# EAGLE design pcb_v2.3 (EAGLE 9.1.1)
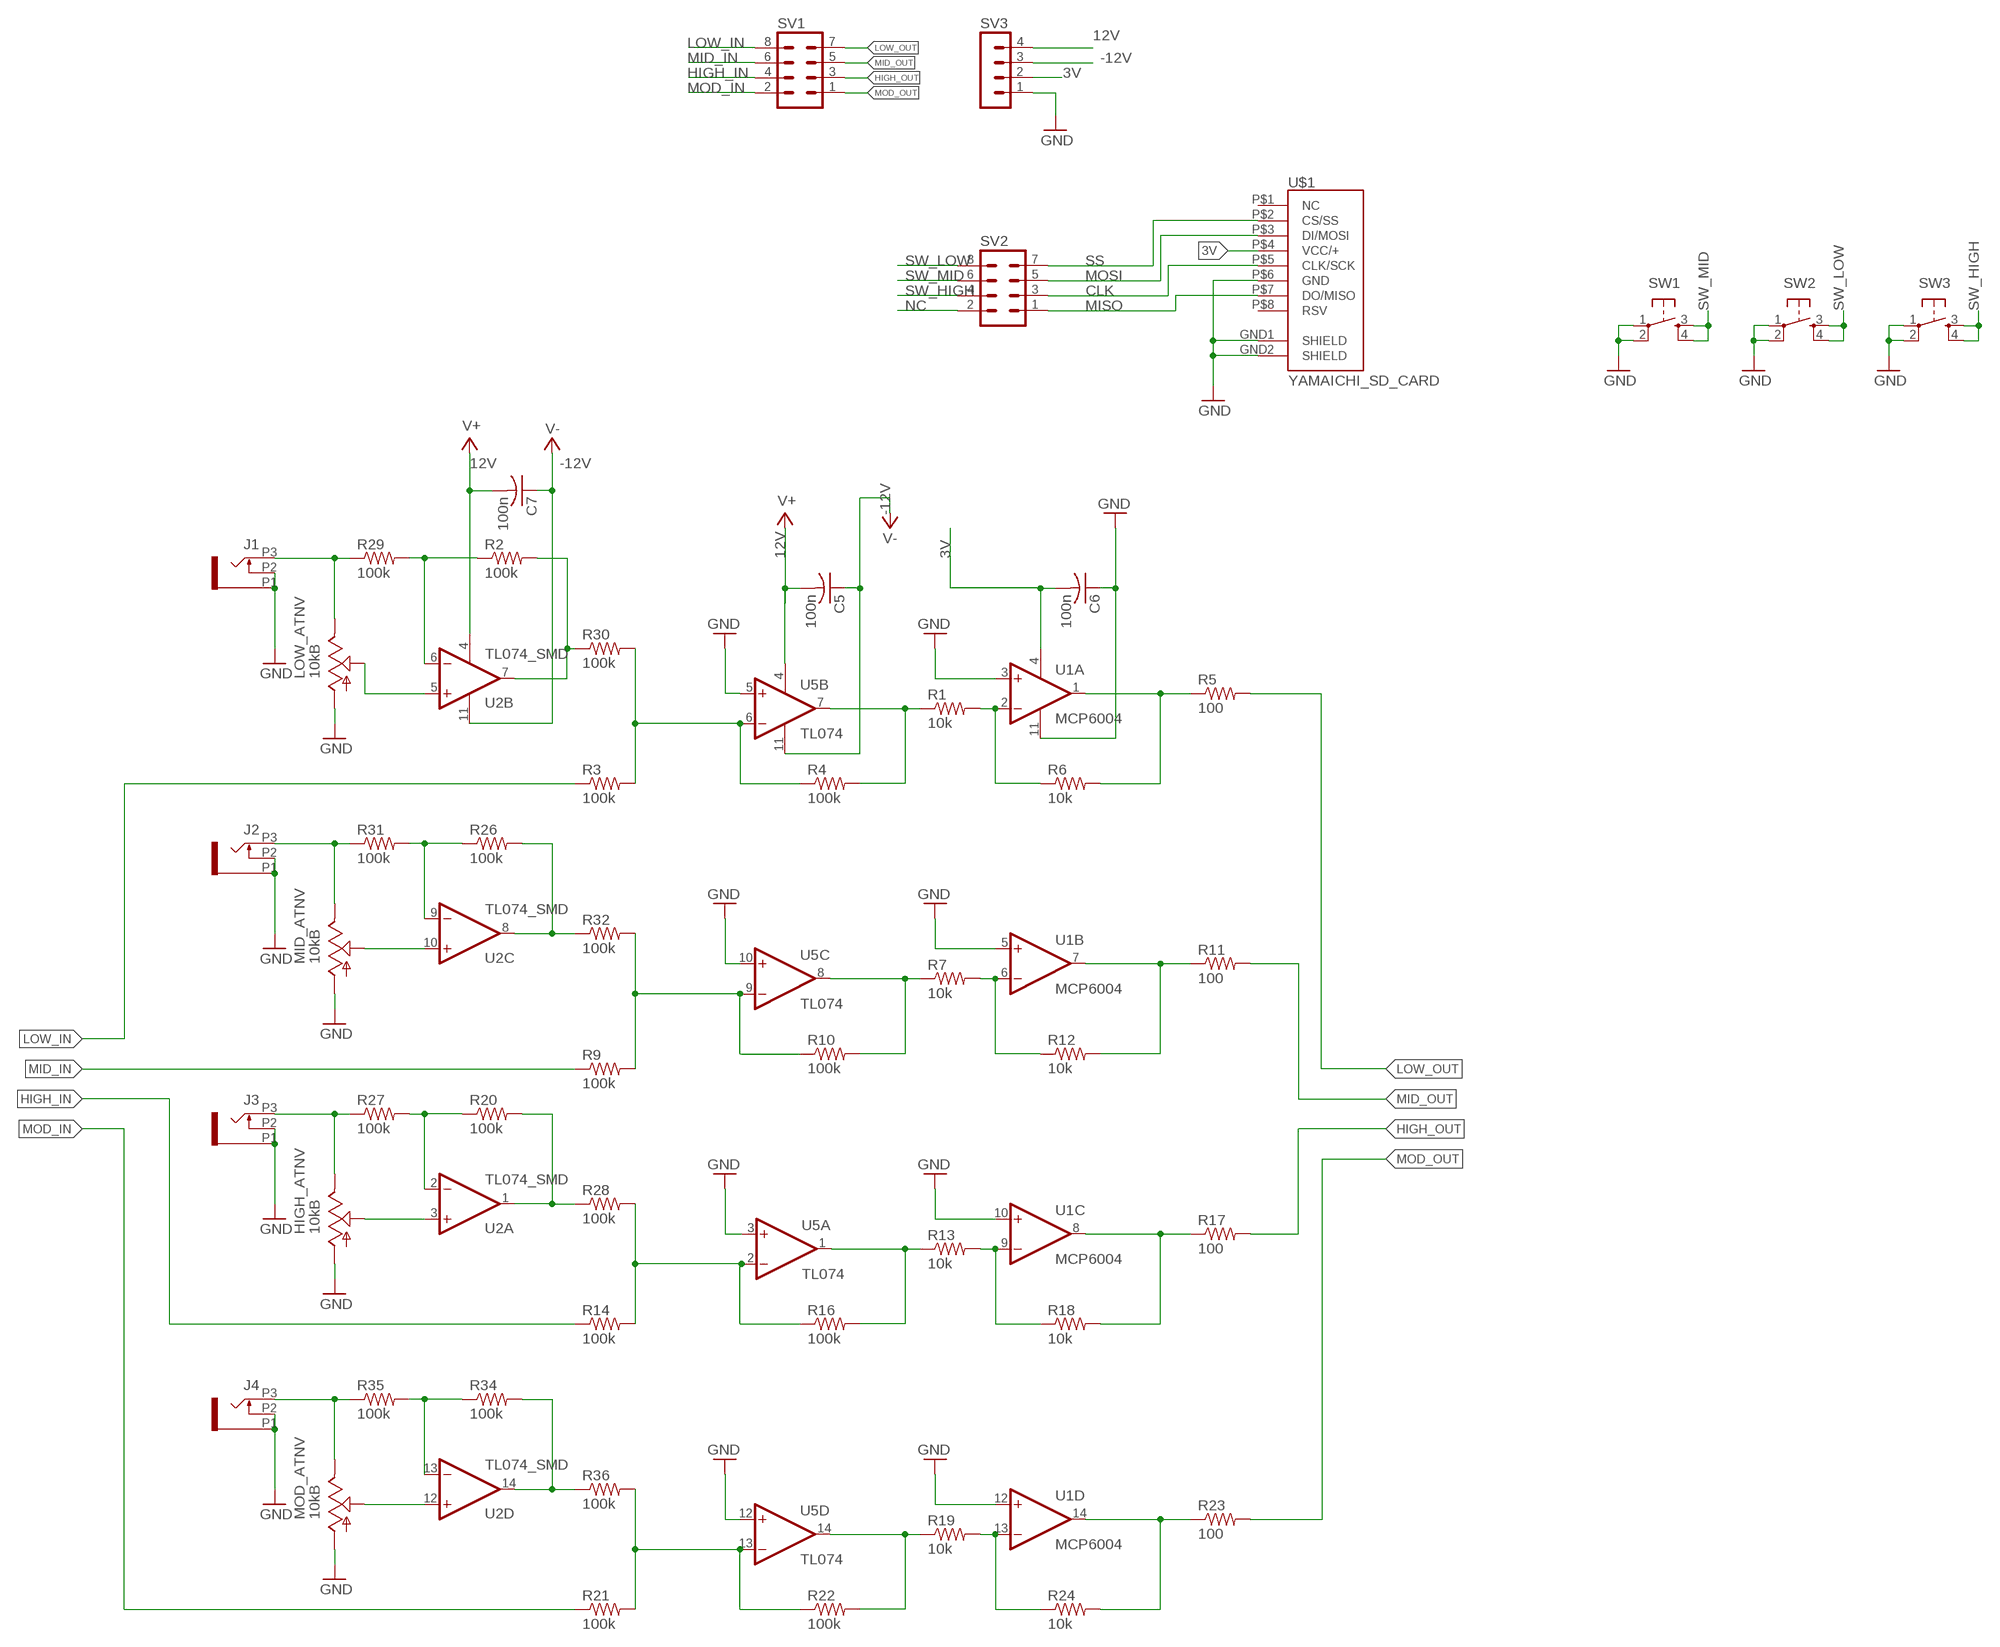
[diagram p0: schematic, sheet 1]

## Parts
C5  100n  C-USC0603  [C0603]
C6  100n  C-USC0603  [C0603]
C7  100n  C-USC0603  [C0603]
HIGH_ATNV  10kB  POT_USVERTICAL  [ALPS_POT_VERTICAL]
J1  PJ301_THONKICONN6  [WQP_PJ_301M6]
J2  PJ301_THONKICONN6  [WQP_PJ_301M6]
J3  PJ301_THONKICONN6  [WQP_PJ_301M6]
J4  PJ301_THONKICONN6  [WQP_PJ_301M6]
LOW_ATNV  10kB  POT_USVERTICAL  [ALPS_POT_VERTICAL]
MID_ATNV  10kB  POT_USVERTICAL  [ALPS_POT_VERTICAL]
MOD_ATNV  10kB  POT_USVERTICAL  [ALPS_POT_VERTICAL]
R1  10k  R-US_R0603  [R0603]
R2  100k  R-US_R0603  [R0603]
R3  100k  R-US_R0603  [R0603]
R4  100k  R-US_R0603  [R0603]
R5  100  R-US_R0603  [R0603]
R6  10k  R-US_R0603  [R0603]
R7  10k  R-US_R0603  [R0603]
R9  100k  R-US_R0603  [R0603]
R10  100k  R-US_R0603  [R0603]
R11  100  R-US_R0603  [R0603]
R12  10k  R-US_R0603  [R0603]
R13  10k  R-US_R0603  [R0603]
R14  100k  R-US_R0603  [R0603]
R16  100k  R-US_R0603  [R0603]
R17  100  R-US_R0603  [R0603]
R18  10k  R-US_R0603  [R0603]
R19  10k  R-US_R0603  [R0603]
R20  100k  R-US_R0603  [R0603]
R21  100k  R-US_R0603  [R0603]
R22  100k  R-US_R0603  [R0603]
R23  100  R-US_R0603  [R0603]
R24  10k  R-US_R0603  [R0603]
R26  100k  R-US_R0603  [R0603]
R27  100k  R-US_R0603  [R0603]
R28  100k  R-US_R0603  [R0603]
R29  100k  R-US_R0603  [R0603]
R30  100k  R-US_R0603  [R0603]
R31  100k  R-US_R0603  [R0603]
R32  100k  R-US_R0603  [R0603]
R34  100k  R-US_R0603  [R0603]
R35  100k  R-US_R0603  [R0603]
R36  100k  R-US_R0603  [R0603]
SV1  MA04-2  [MA04-2]
SV2  MA04-2  [MA04-2]
SV3  MA04-1  [MA04-1]
SW1  TAC_SWITCHPTH  [TACTILE-PTH]
SW2  TAC_SWITCHPTH  [TACTILE-PTH]
SW3  TAC_SWITCHPTH  [TACTILE-PTH]
U1  MCP6004  MCP6004_SMD  [SO14]
U2  TL074_SMD  [SO14]
U5  TL074  TL074_SMD  [SO14]
U$1  YAMAICHI_SD_CARD  [YAMAICHI_MICROSD_VERTICAL]

## Nets
3V: C6.2 SV3.2 U1.4(P:V+) U$1.P$4(VCC/+)
12V: C5.2 C7.2 SV3.4 U2.4(P:V+) U5.4(P:V+) ; supply symbol labelled V+
-12V: C5.1 C7.1 SV3.3 U2.11(P:V-) U5.11(P:V-) ; supply symbol labelled V-
CLK: SV2.3 U$1.P$5(CLK/SCK)
GND: C6.1 HIGH_ATNV.P$3(A) J1.P1 J1.P2 J2.P1 J2.P2 J3.P1 J3.P2 J4.P1 J4.P2 LOW_ATNV.P$3(A) MID_ATNV.P$3(A) MOD_ATNV.P$3(A) SV3.1 SW1.1 SW1.2 SW2.1 SW2.2 SW3.1 SW3.2 U1.3(A:+IN) U1.5(B:+IN) U1.10(C:+IN) U1.11(P:V-) U1.12(D:+IN) U5.3(A:+IN) U5.5(B:+IN) U5.10(C:+IN) U5.12(D:+IN) U$1.GND1(SHIELD) U$1.GND2(SHIELD) U$1.P$6(GND)
HIGH_ATNV_FDBK: R20.1 R27.2 U2.2(A:-IN)
HIGH_IN: R14.1 SV1.4
HIGH_OUT: R17.2 SV1.3
HIGH_SUM_OUT: R13.1 R16.2 U5.1(A:OUT)
LOW_ATNV_FDBK: R2.1 R29.2 U2.6(B:-IN)
LOW_IN: R3.1 SV1.8
LOW_OUT: R5.2 SV1.7
LOW_SUM_OUT: R1.1 R4.2 U5.7(B:OUT)
MID_ATNV_FDBK: R26.1 R31.2 U2.9(C:-IN)
MID_IN: R9.1 SV1.6
MID_OUT: R11.2 SV1.5
MID_SUM_OUT: R7.1 R10.2 U5.8(C:OUT)
MISO: SV2.1 U$1.P$7(DO/MISO)
MOD_ATNV_FDBK: R34.1 R35.2 U2.13(D:-IN)
MOD_IN: R21.1 SV1.2
MOD_OUT: R23.2 SV1.1
MOD_SUM_OUT: R19.1 R22.2 U5.14(D:OUT)
MOSI: SV2.5 U$1.P$3(DI/MOSI)
N$1: MID_ATNV.P$2(S) U2.10(C:+IN)
N$2: R1.2 R6.1 U1.2(A:-IN)
N$3: R2.2 R30.1 U2.7(B:OUT)
N$4: LOW_ATNV.P$2(S) U2.5(B:+IN)
N$5: R5.1 R6.2 U1.1(A:OUT)
N$6: R3.2 R4.1 R30.2 U5.6(B:-IN)
N$7: HIGH_ATNV.P$2(S) U2.3(A:+IN)
N$8: R9.2 R10.1 R32.2 U5.9(C:-IN)
N$9: R7.2 R12.1 U1.6(B:-IN)
N$12: HIGH_ATNV.P$1(E) J3.P3 R27.1
N$13: R20.2 R28.1 U2.1(A:OUT)
N$23: R13.2 R18.1 U1.9(C:-IN)
N$24: R19.2 R24.1 U1.13(D:-IN)
N$26: R11.1 R12.2 U1.7(B:OUT)
N$27: R17.1 R18.2 U1.8(C:OUT)
N$28: R23.1 R24.2 U1.14(D:OUT)
N$30: J1.P3 LOW_ATNV.P$1(E) R29.1
N$32: J2.P3 MID_ATNV.P$1(E) R31.1
N$33: R26.2 R32.1 U2.8(C:OUT)
N$34: MOD_ATNV.P$2(S) U2.12(D:+IN)
N$35: J4.P3 MOD_ATNV.P$1(E) R35.1
N$36: R34.2 R36.1 U2.14(D:OUT)
N$37: R14.2 R16.1 R28.2 U5.2(A:-IN)
N$38: R21.2 R22.1 R36.2 U5.13(D:-IN)
NC: SV2.2
SS: SV2.7 U$1.P$2(CS/SS)
SW_HIGH: SV2.4 SW3.3 SW3.4
SW_LOW: SV2.8 SW2.3 SW2.4
SW_MID: SV2.6 SW1.3 SW1.4
Unconnected: U$1.P$1(NC) U$1.P$8(RSV)

## Library data of the parts
C5-C7 = rcl:C-US: CAPACITOR, American symbol; SPICEPREFIX: C
HIGH_ATNV LOW_ATNV MID_ATNV MOD_ATNV = og-pots:POT_US
J1-J4 = og-pj301:PJ301_THONKICONN; SPICEPREFIX: J
R1-R7 R9-R14 R16-R24 R26-R32 R34-R36 = rcl:R-US_: RESISTOR, American symbol; SPICEPREFIX: R
SV1 SV2 = con-lstb:MA04-2: PIN HEADER; OC_FARNELL: unknown; OC_NEWARK: unknown
SV3 = con-lstb:MA04-1: PIN HEADER; OC_FARNELL: unknown; OC_NEWARK: unknown
SW1-SW3 = SparkFun:TAC_SWITCH: Momentary Switch Button commonly used for reset or general input. Spark Fun Electronics SKU : COM-00097
U1 = MusicThingModular:MCP6004: Generic Quad Op Amp
U2 U5 = MusicThingModular:TL074: Generic Quad Op Amp
U$1 = MusicThingModular:YAMAICHI_SD_CARD: Vertical SD Card Holder

## Board
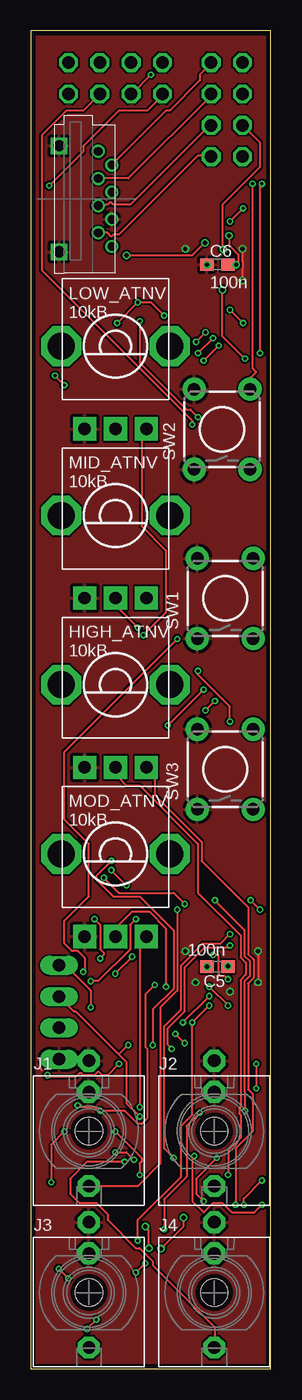
[diagram p1: board, top side]
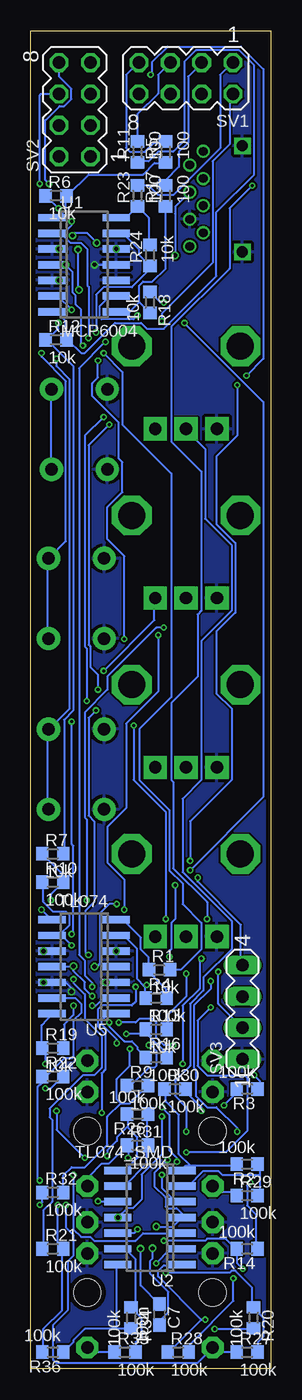
[diagram p2: board, bottom side, seen from below]

Size 19.43 x 108.43 mm. Coordinates in mm from the lower left corner, seen from the top.
Outline: 0,0 19.43,0 19.43,108.43 0,108.43 0,0
Copper layers (1*16): Top 0.035559375mm / dielectric 1.6mm / Bottom 0.035559375mm
Design rules "oshpark-2layer *": minimum track width 6mil, minimum drill 10mil, track to track 6mil, track to pad 6mil, pad to pad 6mil, via to via 6mil, smd to smd 0mil, copper to edge 15mil, drill to drill 6mil, minimum pad ring 5mil, minimum via ring 5mil, stop-mask expansion 2.5mil, vias tented up to drill 0mil, thermal gap 10mil

### Footprints (pad centres in the part's own frame; a part is rotated, then mirrored left to right if it is on the bottom)
C0603 = smd 1.1 x 1: 1 -0.85,0; 2 0.85,0
ALPS_POT_VERTICAL = drill 1 pad 1.88 square: P$1 -2.5,6.7; P$2 0,6.7; P$3 2.5,6.7 | drill 2.2 pad 3.175 octagon: P$4 -4.4,0; P$5 4.4,0
WQP_PJ_301M6 = drill 1.016 pad 1.778 octagon: P1 0,-5.715; P2 0,-3.175; P3 0,4.445 | hole 2.2: 0,0
R0603 = smd 1 x 1.1: 1 -0.85,0; 2 0.85,0
MA04-2 = drill 1.016 octagon: 1 -3.81,-1.27; 2 -3.81,1.27; 3 -1.27,-1.27; 4 -1.27,1.27; 5 1.27,-1.27; 6 1.27,1.27; 7 3.81,-1.27; 8 3.81,1.27
MA04-1 = drill 1.016 long: 1 -3.81,0; 2 -1.27,0; 3 1.27,0; 4 3.81,0
TACTILE-PTH = drill 1.016 pad 1.88: 1 -3.251,2.261; 2 3.251,2.261; 3 -3.251,-2.261; 4 3.251,-2.261
SO14 = smd 0.6 x 2.2: 1 -3.81,-2.6; 2 -2.54,-2.6; 3 -1.27,-2.6; 4 0,-2.6; 5 1.27,-2.6; 6 2.54,-2.6; 7 3.81,-2.6; 8 3.81,2.6; 9 2.54,2.6; 10 1.27,2.6; 11 0,2.6; 12 -1.27,2.6; 13 -2.54,2.6; 14 -3.81,2.6
YAMAICHI_MICROSD_VERTICAL = drill 0.9 square: GND1 -4.3,-3.17; GND2 4.3,-3.17 | drill 0.7: P$1 -3.85,0; P$2 -2.75,1.1; P$3 -1.65,0; P$4 -0.55,1.1; P$5 0.55,0; P$6 1.65,1.1; P$7 2.75,0; P$8 3.85,1.1

### Placement (x,y rotation side)
C5  15.11,32.58 180 top
C6  15.11,89.47 0 top
C7  9.02,4.38 270 bottom
HIGH_ATNV  6.86,55.44 180 top
J1  4.7,19.24 180 top
J2  14.86,19.24 180 top
J3  4.7,6.16 180 top
J4  14.86,6.16 180 top
LOW_ATNV  6.86,82.87 180 top
MID_ATNV  6.86,69.15 180 top
MOD_ATNV  6.86,41.72 180 top
R1  9.02,32.32 0 bottom
R2  1.91,16.57 180 bottom
R3  1.91,22.67 180 bottom
R4  9.27,30.04 0 bottom
R5  8.51,98.62 90 bottom
R6  17.4,95.06 0 bottom
R7  17.65,41.72 0 bottom
R9  10.79,22.92 0 bottom
R10  17.65,39.43 0 bottom
R11  10.79,98.62 90 bottom
R12  17.4,83.38 0 bottom
R13  9.27,27.5 0 bottom
R14  1.91,9.72 180 bottom
R16  9.27,25.21 0 bottom
R17  8.51,95.06 90 bottom
R18  9.78,86.42 270 bottom
R19  17.65,25.97 0 bottom
R20  1.4,4.13 270 bottom
R21  17.65,9.72 0 bottom
R22  17.65,23.69 0 bottom
R23  10.79,95.06 90 bottom
R24  9.78,90.23 90 bottom
R26  10.79,20.64 180 bottom
R27  1.91,1.33 0 bottom
R28  7.49,1.33 0 bottom
R29  1.91,14.03 0 bottom
R30  7.75,22.67 0 bottom
R31  10.79,18.1 0 bottom
R32  17.65,14.29 0 bottom
R34  11.3,4.13 270 bottom
R35  11.81,1.33 0 bottom
R36  17.65,1.33 180 bottom
SV1  6.86,104.58 180 bottom
SV2  15.88,102.04 90 bottom
SV3  2.29,28.89 90 bottom
SW1  15.75,62.42 90 top
SW2  15.49,76.14 90 top
SW3  15.75,48.58 90 top
U1  15.11,89.47 270 bottom
U2  9.78,12.26 90 bottom
U5  15.11,32.58 90 bottom
U$1  5.46,94.81 270 top

### Tracks (layer width: path | path; a pad name or v marks a point on that pad's centre or on a via)
3V  (via drill 0.25, 0.35)
  Top 0.152: C6.2 v16.64,89.47 16.82,89.66 16.82,90.3 16.06,91.07 v16.06,91.83 | v14,81.7 v15.21,82.92 | v11.86,59.14 2.72,50 2.72,44.51 4.7,42.53 4.7,38.27 2.72,36.28 2.72,34.46 3.33,33.85 3.79,33.85 4.39,33.24 4.39,32.32 v4.24,32.17 | v7.75,90.23 13.08,90.23 v14.1,91.25
  Bottom 0.152: U1.4 v16.64,89.47 16.05,88.88 16.05,87.22 15.8,86.97 15.8,86.25 | 15.8,86.25 15.37,85.81 15.37,83.07 v15.21,82.92 | 15.8,86.25 15.82,86.27 | v14,81.7 14,80.33 14.45,79.87 14.45,78.8 12.32,76.67 12.32,73.77 12.01,73.47 12.01,71.03 13.23,69.81 13.23,67.22 11.86,65.85 v11.86,59.14 | v4.24,32.17 4.24,29.58 SV3.2 | U$1.P$4 7.73,94.19 7.73,93.61 7.75,93.6 v7.75,90.23 | v14.1,91.25 14.86,92.01 15.88,92.01 v16.06,91.83
12V  (via drill 0.25, 0.35)
  Top 0.152: v8.36,16.93 7.75,17.54 v6.83,17.54 | v4.85,29.27 4.85,30.65 2.87,32.63 2.41,32.63 SV3.4 | v12.47,37.66 11.56,38.57 7.14,38.57 v5.92,39.79 | v9.57,9.76 9.57,11.19 9.27,11.49 v9.27,11.52
  Bottom 0.152: v8.36,16.93 9.42,15.86 9.42,14.8 8.51,13.88 8.51,13.13 8.37,13 7.62,13 7.18,12.55 U2.4 7.92,11.52 v9.27,11.52 | v6.83,17.54 3.63,17.54 1.91,19.27 1.91,23.58 2.11,23.79 5.16,23.79 5.92,24.55 5.92,28.21 v4.85,29.27 | v12.47,37.66 13.08,37.66 13.84,36.89 13.84,32.83 | v5.92,39.79 5.92,39.48 2.41,35.98 2.41,32.78 SV3.4 | C7.2 9.02,3.86 8.29,4.59 8.29,6.22 9.75,7.68 9.75,8.75 9.57,8.93 v9.57,9.76 | 13.84,32.83 13.59,32.58 U5.4 | 13.84,32.83 14.1,32.58 C5.2
  other vias: 14.26,32.58
-12V  (via drill 0.25, 0.35)
  Top 0.152: v15.98,32.63 C5.1 | v8.81,20.43 7.75,21.5 7.75,24.85 7.14,25.46 | 7.14,25.46 3.63,28.97 3.48,28.97 SV3.3 | v12.32,28.05 v14.45,30.19 | 7.14,25.46 v7.9,26.23 | v10.54,9.72 12.38,11.55 U2.11
  Bottom 0.152: v8.81,20.43 8.81,17.39 10.46,15.74 10.46,13.72 11.18,13 11.64,13 U2.11 | v12.32,28.05 10.95,28.05 10.64,28.36 9.58,28.36 9.27,28.05 9.27,26.84 8.66,26.23 v7.9,26.23 | C7.1 10.54,6.76 v10.54,9.72 | v14.45,30.19 15.06,30.8 15.06,31.33 15.98,32.24 v15.98,32.63 16.03,32.58 U5.11
  other vias: 12.38,12.26
CLK
  Top 0.152: U$1.P$5 5.46,94.2 5.92,94.2 6.07,94.35 6.22,94.35 6.38,94.5 6.53,94.5 6.68,94.35 8.05,94.35 14.61,100.9 SV2.3
GND  (via drill 0.35)
  Top 0.152: v17.14,90.74 17.14,89.71 17.17,89.69 17.17,89.25 17.14,89.23 v17.14,88.2 | v18.41,33.85 v18.41,31.31 | SV3.1 0.76,25.08 0.76,24.32 0.89,24.19
  Bottom 0.152: U5.12 16.61,31.31 16.13,30.82 v16.13,30.57 | U1.12 v12.51,90.76 | U1.3 v17.14,90.74 | U5.10 v18.41,33.85 | U5.3 v13.34,31.31 | C6.1 U1.11
  other vias: 12.51,33.85 14.26,89.47
  pour Bottom: -0.13,108.52 19.68,108.52 19.68,-0.7 0.38,-0.7 -0.13,-0.19
  pour Top: -0.64,109.03 20.19,109.03 20.19,-0.7 19.68,-1.21 0.38,-1.21 -0.64,-0.19
HIGH_ATNV_FDBK  (via drill 0.25)
  Top 0.152: v8.51,7.79 v9.27,8.55
  Bottom 0.152: R27.2 1.04,1.38 1.04,2.15 0.58,2.6 0.58,4.13 1.35,4.89 R20.1 1.5,5.04 1.5,6.57 2.87,7.94 3.17,7.94 3.33,7.79 v8.51,7.79 | v9.27,8.55 8.2,9.61 7.29,9.61 U2.2
HIGH_IN  (via drill 0.25)
  Top 0.152: v1.65,15.1 1.65,18.15 v2.72,19.22 | v4.85,31.41 5.46,31.41 8.05,34 8.05,35.98 v8.51,36.44 | v14,55.03 v11.1,52.13 | v13.08,76.52 13.08,76.82 0.89,89.01 0.89,99.99 2.87,101.97 4.24,101.97 SV1.4
  Bottom 0.152: v2.72,19.22 2.72,19.52 4.39,21.2 5.16,21.2 6.07,22.11 6.07,24.24 6.22,24.4 6.22,29.43 4.85,30.8 v4.85,31.41 | v8.51,36.44 8.51,45.12 11.1,47.71 v11.1,52.13 | v14,55.03 14,56.25 14.61,56.86 14.61,58.53 14.76,58.69 14.76,74.84 v13.08,76.52 | R14.1 1.19,9.77 1.19,12.51 1.91,13.22 1.91,14.85 v1.65,15.1
HIGH_OUT
  Bottom 0.152: R17.2 8.51,96.33 7.44,97.4 7.44,98.62 6.68,99.38 6.68,104.71 5.61,105.78 SV1.3
HIGH_SUM_OUT  (via drill 0.25)
  Top 0.152: v11.71,27.14 v12.47,26.38
  Bottom 0.152: 10.03,27.14 8.51,25.62 8.51,25.31 R16.2 | 10.03,27.14 10.03,27.44 R13.1 10.03,27.14 | v12.47,26.38 12.47,26.68 13.69,27.9 13.69,28.21 13.23,28.66 12.62,28.66 U5.1 | 10.03,27.14 v11.71,27.14
LOW_ATNV_FDBK
  Bottom 0.152: 0.89,15.71 0.89,16.38 R2.1 | 0.89,15.71 0.89,14.13 R29.2 | 0.89,15.71 3.94,15.71 4.24,16.01 5.46,16.01 6.68,14.8 U2.6
LOW_IN  (via drill 0.25)
  Top 0.152: v1.35,23.79 1.5,23.63 3.63,23.63 3.94,23.94 4.09,23.94 4.24,23.79 5.16,23.79 5.46,24.09 5.77,23.79 6.22,23.79 v7.14,24.7 | v5.61,33.24 5.92,33.54 5.92,33.69 5.61,34 5.61,35.98 v5.16,36.44 | v1.5,95.87 4.24,98.62 4.24,99.07 7.14,101.97 9.42,101.97 10.64,103.19 SV1.8
  Bottom 0.152: v1.35,23.79 0.89,23.33 0.89,22.77 R3.1 | v7.14,24.7 7.14,29.43 5.77,30.8 5.77,33.08 v5.61,33.24 | v5.16,36.44 5.16,37.81 7.9,40.55 7.9,47.56 8.05,47.71 8.05,53.96 5.92,56.1 5.92,61.13 5.61,61.43 5.61,72.71 8.05,75.15 8.05,84.44 3.33,89.17 3.33,94.04 v1.5,95.87
LOW_OUT
  Bottom 0.152: R5.2 8.51,99.38 9.42,99.38 10.19,98.62 11.4,98.62 11.71,98.92 11.71,104.86 10.79,105.78 SV1.7
LOW_SUM_OUT
  Bottom 0.152: R4.2 8.51,30.04 8.51,30.8 9.87,32.16 R1.1 9.88,32.32 9.88,33.34 10.53,33.99 10.53,34.95 11.86,36.28 12.47,36.28 U5.7
MID_ATNV_FDBK
  Bottom 0.152: R26.1 10.03,20.59 10.03,18.15 R31.2 10.03,18 10.03,16.62 11.86,14.8 U2.9
MID_IN  (via drill 0.25)
  Top 0.152: v9.88,26.23 9.88,29.12 11.56,30.8 11.56,35.52 8.81,38.27 6.68,38.27 5.31,39.64 5.31,39.94 v6.53,41.16 | v1.96,80.48 v2.72,79.72 | v9.73,104.86 8.2,103.34 SV1.6
  Bottom 0.152: v9.88,26.23 9.73,26.23 9.27,25.77 9.27,24.55 9.42,24.4 9.88,24.4 11.25,23.03 11.56,23.03 R9.1 | v6.53,41.16 6.53,44.36 3.17,47.71 3.17,53.51 4.39,54.72 4.39,59.75 2.87,61.28 2.87,66.92 4.39,68.44 4.39,73.93 2.72,75.6 v2.72,79.72 | v1.96,80.48 0.58,81.85 0.58,105.32 2.41,107.15 8.36,107.15 9.58,105.93 9.58,105.02 v9.73,104.86
MID_OUT
  Bottom 0.152: R11.2 10.79,101.66 9.12,103.34 9.12,104.86 SV1.5
MID_SUM_OUT  (via drill 0.25)
  Top 0.152: v17.8,37.96 v18.57,37.2
  Bottom 0.152: R7.1 18.41,41.62 16.89,40.09 16.89,39.48 R10.2 16.89,39.33 17.8,38.42 v17.8,37.96 | v18.57,37.2 17.8,36.44 U5.8
MISO
  Top 0.152: U$1.P$7 6.22,92.06 6.53,91.76 6.68,91.91 7.14,91.91 13.54,98.31 14.61,98.31 SV2.1
MOD_ATNV_FDBK
  Bottom 0.152: R35.2 10.95,1.38 10.95,2.15 10.49,2.6 10.49,4.13 11.25,4.89 R34.1 11.25,5.04 10.95,5.35 10.95,8.85 11.71,9.61 12.32,9.61 U2.13
MOD_IN  (via drill 0.25)
  Top 0.152: v14.91,54.11 v14.15,53.35 | v13.54,77.13 12.93,77.74 12.62,77.74 8.81,81.55 v8.81,84.9 | v14.76,33.54 15.18,33.54 15.18,31.98 15.32,31.85 15.69,31.85 v15.98,31.56
  Bottom 0.152: v15.98,31.56 15.98,31.25 15.06,30.34 15.06,28.36 13.69,26.99 13.69,24.4 14.3,23.79 15.21,23.79 17.91,21.09 17.91,20.38 17.7,20.18 17.7,13.53 18.41,12.81 18.41,9.77 R21.1 | v14.15,53.35 14.76,52.74 14.76,44.82 14.3,44.36 14.3,37.81 15.01,37.1 15.01,33.79 v14.76,33.54 | v14.91,54.11 14.91,58.38 15.06,58.53 15.06,75.6 v13.54,77.13 | v8.81,84.9 8.81,85.51 4.7,89.62 4.7,97.85 3.33,99.23 3.33,103.04 SV1.2
MOD_OUT
  Bottom 0.152: R23.2 10.79,95.87 9.88,95.87 9.12,95.11 7.9,95.11 4.09,98.92 4.09,104.86 3.17,105.78 SV1.1
MOD_SUM_OUT  (via drill 0.25)
  Top 0.152: v18.26,24.7 v18.26,22.72
  Bottom 0.152: v18.26,22.72 17.8,22.72 16.89,23.63 R22.2 | v18.26,24.7 18.26,25.77 18.41,25.92 R19.1 18.57,26.04 18.57,27.83 U5.14
MOSI
  Top 0.152: U$1.P$3 5.46,96.48 7.9,96.48 14.61,103.19 SV2.5
N$1  (via drill 0.25)
  Top 0.152: v14,13.58 13.39,14.19 13.39,15.41 v15.06,17.08 | v17.35,20.89 17.35,22.42 17.3,22.47 17.3,31.38 17.73,31.81 17.73,33.03 17.3,33.47 17.3,35.57 v14.91,37.96 | v8.66,60.06 6.99,61.73 6.99,62.34 MID_ATNV.P$2
  Bottom 0.152: v14,13.58 12.47,13.58 U2.10 | v15.06,17.08 17.35,19.37 v17.35,20.89 | v14.91,37.96 14.91,44.51 15.06,44.67 15.06,53.2 13.23,55.03 13.23,56.1 9.27,60.06 v8.66,60.06
N$2  (via drill 0.25)
  Top 0.152: v14.76,83.53 v13.54,82.31 | v16.13,92.98 v17.2,94.04
  Bottom 0.152: R1.2 7.29,32.32 5.61,34 5.61,36.13 7.14,37.66 7.14,39.33 8.2,40.4 8.2,45.28 10.64,47.71 10.64,51.83 8.05,54.42 8.05,72.56 12.01,76.52 12.01,80.78 v13.54,82.31 | v14.76,83.53 14.76,87.69 14.86,87.8 14.86,90.72 15.37,91.23 16.21,91.23 16.89,91.91 | 16.89,91.91 17.65,91.91 U1.2 16.89,91.91 | v17.2,94.04 18.11,94.96 R6.1 | v16.13,92.98 16.13,92.67 16.89,91.91
N$3
  Bottom 0.152: 6.53,16.47 6.83,16.47 7.14,16.17 U2.7 | 6.53,16.47 2.82,16.47 R2.2 | 6.53,16.47 7.44,17.39 7.44,20.59 8.51,21.65 8.51,22.57 R30.1
N$4  (via drill 0.25)
  Top 0.152: v8.81,15.71 8.81,16.62 8.97,16.78 8.97,17.08 v6.83,19.22
  Bottom 0.152: v8.81,15.71 8.81,14.64 7.75,13.58 7.29,13.58 U2.5 | v6.83,19.22 6.83,21.2 7.75,22.11 7.75,23.33 6.53,24.55 6.53,29.58 5.46,30.65 5.46,31.71 3.17,34 3.17,36.28 7.14,40.25 7.14,46.19 5.61,47.71 5.61,58.99 3.17,61.43 3.17,66.76 5.31,68.9 5.31,74.54 6.83,76.06 LOW_ATNV.P$2
N$5
  Bottom 0.152: U1.1 17.2,93.28 16.59,93.89 16.59,94.96 R6.2 16.43,95.11 14.76,96.79 10.34,96.79 9.42,97.7 8.51,97.7 R5.1
N$6  (via drill 0.25)
  Top 0.152: v3.79,21.35 3.94,21.5 4.24,21.2 5.16,21.2 5.46,20.89 v5.61,20.89 7.6,20.89 8.66,19.82 8.97,19.82 9.42,20.28 9.42,25.92 9.27,26.07 9.27,30.34 v10.03,31.1
  Bottom 0.152: v3.79,21.35 2.75,22.38 R3.2 | v5.61,20.89 5.61,21.2 6.99,22.57 R30.2 | 10.19,30.95 10.19,30.04 R4.1 | 10.19,30.95 10.85,31.61 10.85,34.05 11.86,35.06 12.47,35.06 U5.6 | 10.19,30.95 v10.03,31.1
N$7  (via drill 0.25)
  Top 0.152: v15.98,15.71 15.98,17.69 16.99,18.71 16.99,20.56 16.87,20.69 16.87,21.09 16.99,21.22 16.99,31.5 17.43,31.94 17.43,32.9 16.99,33.34 16.99,35.12 13.54,38.57 13.54,42.53 8.81,47.26 7.75,47.26 6.99,48.02 6.99,48.63 HIGH_ATNV.P$2
  Bottom 0.152: U2.3 10.34,10.99 10.95,10.38 14.3,10.38 14.61,10.68 15.37,10.68 15.98,11.29 v15.98,15.71
N$8  (via drill 0.25)
  Top 0.152: v16.13,34.3 15.98,34.15 14.1,34.15 12.47,32.52 12.47,28.97 11.1,27.6 11.1,26.23 v11.4,25.92
  Bottom 0.152: 17.04,35.22 16.28,35.98 16.28,36.74 16.59,37.05 17.65,37.05 18.41,37.81 18.41,37.91 18.41,39.33 R10.1 | 17.04,35.22 17.65,35.22 U5.9 17.04,35.22 | 12.17,21.5 11.4,21.5 10.03,22.87 R9.2 | 12.17,21.5 13.23,20.43 13.23,18.15 15.06,16.32 16.13,16.32 16.79,15.66 16.79,14.3 R32.2 | v16.13,34.3 17.04,35.22 | v11.4,25.92 11.4,24.55 12.47,23.48 12.47,21.81 12.17,21.5
N$9  (via drill 0.25)
  Top 0.152: v17.2,84.75 v16.13,85.81
  Bottom 0.152: 18.11,83.38 15.98,81.24 15.98,53.35 16.74,52.59 16.74,41.77 R7.2 | v16.13,85.81 17.2,86.88 17.65,86.88 U1.6 | v17.2,84.75 17.2,84.29 18.11,83.38 | 18.11,83.38 R12.1
N$12  (via drill 0.25)
  Top 0.152: v16.59,13.27 16.59,17.84 17.96,19.22 17.96,22.26 17.6,22.62 17.6,31.24 18.04,31.68 18.04,33.15 17.6,33.59 17.6,37.4 13.84,41.16 13.84,42.68 10.03,46.49 10.03,48.02 9.42,48.63 HIGH_ATNV.P$1
  Bottom 0.152: 4.7,1.69 4.39,1.38 2.87,1.38 R27.1 | 4.7,1.69 5.92,0.47 17.35,0.47 17.65,0.77 17.65,3.52 16.43,4.74 16.43,8.7 15.98,9.16 15.98,10.83 16.59,11.44 v16.59,13.27 | 4.7,1.69 J3.P3
N$13  (via drill 0.25)
  Top 0.152: v5.31,3.98 v4.55,3.21
  Bottom 0.152: v4.55,3.21 1.5,3.21 R20.2 | 5.61,3.98 v5.31,3.98 | 5.61,3.98 8.2,1.38 R28.1 | 5.61,3.98 9.12,7.48 9.12,7.94 8.66,8.39 7.29,8.39 U2.1
N$23  (via drill 0.25)
  Top 0.152: v8.2,33.39 v6.83,32.02 | v6.53,40.4 v7.75,39.18 | v6.99,84.75 v8.66,86.42 9.73,86.42 v10.79,85.36
  Bottom 0.152: v6.83,32.02 6.83,30.19 8.36,28.66 8.36,27.6 R13.2 | v8.2,33.39 8.2,33.85 8.05,34 8.05,36.13 7.75,36.44 v7.75,39.18 | v6.53,40.4 0.58,46.34 0.58,78.35 v6.99,84.75 | v8.66,86.42 8.97,86.42 9.73,87.19 R18.1 | v10.79,85.36 11.1,85.05 13.69,85.05 13.84,85.2 13.84,86.12 13.08,86.88 12.62,86.88 U1.9
N$24  (via drill 0.25)
  Top 0.152: v14.45,30.95 v15.98,29.43 | v14.15,83.99 v13.39,83.22
  Bottom 0.152: v15.98,29.43 15.98,28.66 16.74,27.9 16.74,26.07 R19.2 | v14.45,30.95 14.45,31.25 15.06,31.86 15.06,33.08 15.52,33.54 15.52,81.09 v13.39,83.22 | v14.15,83.99 14.15,87.03 13.54,87.64 11.25,87.64 9.88,89.01 9.88,89.32 R24.1 9.88,89.47 10.64,90.23 10.64,90.69 11.86,91.91 12.47,91.91 U1.13
N$26
  Bottom 0.152: R11.1 10.79,97.85 9.88,97.85 9.12,98.62 7.9,98.62 6.99,99.53 6.99,105.93 6.07,106.85 2.57,106.85 1.35,105.63 1.35,96.79 4.39,93.74 4.39,88.56 8.66,84.29 10.03,84.29 10.49,84.75 12.62,84.75 15.06,82.31 15.37,82.31 16.43,83.38 R12.2 16.59,83.38 16.59,84.9 17.35,85.66 U1.7
N$27
  Bottom 0.152: R17.1 8.51,89.17 9.58,88.1 10.34,88.1 10.64,87.8 10.64,86.42 | 10.64,86.42 9.88,85.66 R18.2 | U1.8 11.4,85.66 10.64,86.42
N$28
  Bottom 0.152: 10.79,94.2 9.88,93.28 9.88,91.15 R24.2 | U1.14 11.71,93.28 10.79,94.2 | 10.79,94.2 R23.1
N$30  (via drill 0.25)
  Top 0.152: J1.P3 8.66,14.8 10.49,16.62 10.49,29.27 11.86,30.65 v11.86,37.2 | v9.12,59.45 10.95,61.28 10.95,66.31 8.97,68.29 8.97,75.76 9.27,76.06 LOW_ATNV.P$1
  Bottom 0.152: J1.P3 4.24,14.34 3.14,14.34 R29.1 | v11.86,37.2 11.86,39.64 13.23,41.01 13.23,43.9 11.71,45.43 11.71,52.29 9.12,54.88 v9.12,59.45
N$32  (via drill 0.25)
  Top 0.152: v13.54,56.55 13.54,56.25 16.13,53.66 v16.13,52.44 | v16.13,35.22 15.37,34.46 13.95,34.46 12.17,32.68 12.17,29.12 10.79,27.75 10.79,17.84 v11.56,17.08
  Bottom 0.152: J2.P3 14.76,14.95 14.76,15.56 13.69,16.62 13.08,16.62 11.71,18 R31.1 11.56,18 v11.56,17.08 | v13.54,56.55 9.42,60.67 9.42,62.34 MID_ATNV.P$1 | v16.13,52.44 16.13,42.53 15.98,42.38 15.98,35.37 v16.13,35.22
N$33  (via drill 0.25)
  Top 0.152: v18.72,13.27 18.11,12.66 16.28,12.66 15.52,13.42 14.76,13.42 14,12.66 13.08,13.58 13.08,17.08 v13.23,17.23
  Bottom 0.152: 11.56,19.67 11.56,19.52 10.79,18.76 10.79,17.08 11.71,16.17 12.32,16.17 U2.8 | 11.56,19.67 11.56,20.59 R26.2 | v13.23,17.23 13.23,17.69 12.47,18.45 12.47,18.76 11.56,19.67 | v18.72,13.27 18.5,13.49 R32.1
N$34  (via drill 0.25)
  Top 0.152: v10.79,11.29 10.79,13.73 12.62,15.56 12.62,19.67 v13.69,20.74 | v10.95,30.95 10.95,35.67 9.58,37.05 8.2,37.05 6.99,35.83 6.99,35.06 MOD_ATNV.P$2
  Bottom 0.152: U2.12 11.1,10.99 v10.79,11.29 | v13.69,20.74 13.69,23.94 13.39,24.24 13.39,27.14 14,27.75 14,29.12 13.69,29.43 11.25,29.43 10.95,29.73 v10.95,30.95
N$35  (via drill 0.25)
  Top 0.152: v7.6,16.78 4.55,16.78 3.17,15.41 3.17,14.19 3.94,13.42 5.31,13.42 6.22,12.51 6.22,12.05 8.51,9.77 8.81,9.77 9.88,8.7 9.88,8.39 14.91,3.37 14.91,1.84 J4.P3 | v8.81,21.2 8.81,34.46 9.27,34.91 MOD_ATNV.P$1
  Bottom 0.152: R35.1 12.78,1.38 14.45,1.38 14.76,1.69 J4.P3 | v7.6,16.78 7.6,17.08 8.2,17.69 8.2,20.59 v8.81,21.2
N$36
  Bottom 0.152: 12.47,3.21 11.4,3.21 R34.2 | 12.47,3.21 15.06,3.21 15.98,2.3 15.98,2.15 16.74,1.38 R36.1 | 12.47,3.21 12.47,8.39 U2.14
N$37  (via drill 0.25)
  Top 0.152: v14.45,29.43 v13.08,28.05 13.08,20.59 12.17,19.67 12.17,15.56 8.66,12.05 v8.66,10.38 | v3.02,7.33 v2.26,8.09
  Bottom 0.152: v13.08,28.05 13.08,27.75 11.86,26.53 11.25,26.53 10.79,26.07 10.79,25.92 10.19,25.31 R16.1 | v14.45,29.43 14.15,29.43 13.54,30.04 U5.2 | v2.26,8.09 2.72,8.55 2.72,9.61 R14.2 2.87,9.77 3.63,10.53 5.16,10.53 5.31,10.38 v8.66,10.38 | v3.02,7.33 3.02,5.5 6.53,1.99 6.53,1.38 R28.2
N$38  (via drill 0.25)
  Top 0.152: v18.72,15.25 17.25,13.78 v17.25,13.27
  Bottom 0.152: U5.13 15.82,30.04 15.37,29.58 15.37,28.82 15.98,28.21 15.98,25.31 16.13,25.16 16.74,25.16 18.11,23.79 18.41,23.79 R22.1 18.57,23.63 18.57,23.18 18.87,22.87 18.87,15.41 v18.72,15.25 | R36.2 18.41,1.38 18.41,3.21 16.89,4.74 16.89,9.61 R21.2 16.89,9.77 17.25,10.12 v17.25,13.27
SS
  Top 0.152: U$1.P$2 6.68,97.7 10.95,101.97 11.25,101.97 13.69,104.41 13.69,104.86 14.61,105.78 SV2.7
SW_HIGH  (via drill 0.25, 0.35)
  Top 0.152: v15.52,87.44 15.52,83.68 v17.35,81.85 | SV2.4 17.2,100.75 18.57,99.38 18.57,97.4 15.52,94.35 15.52,90.74 15.56,90.7 v15.62,90.7
  Bottom 0.152: v17.35,81.85 17.35,81.24 16.28,80.18 16.28,53.51 17.96,51.83 SW3.4 18.11,51.83 18.11,45.43 SW3.3 | v15.62,90.7 15.62,87.54 v15.52,87.44
SW_LOW  (via drill 0.25)
  Top 0.152: v17.96,96.02 17.96,81.09 18.26,80.78 17.8,80.33 17.8,79.41 SW2.4
  Bottom 0.152: 18.26,101.16 18.26,96.33 v17.96,96.02 | 18.26,101.16 18.26,101.21 | SW2.3 17.8,73.01 17.8,79.26 SW2.4 | SV2.8 17.14,104.72 16.15,103.72 16.15,102.9 16.73,102.32 17.09,102.32 18.26,101.16
SW_MID  (via drill 0.25)
  Top 0.152: v18.72,96.02 18.57,95.87 v18.57,82.31
  Bottom 0.152: v18.72,96.02 18.72,103.19 18.59,103.31 SV2.6 | v18.57,82.31 18.57,82 16.59,80.02 16.59,67.07 17.96,65.7 SW1.4 18.11,65.54 18.11,59.3 SW1.3